# Altium schematic sheet QCopterFC_PWM_Sch.SchDoc
size A4
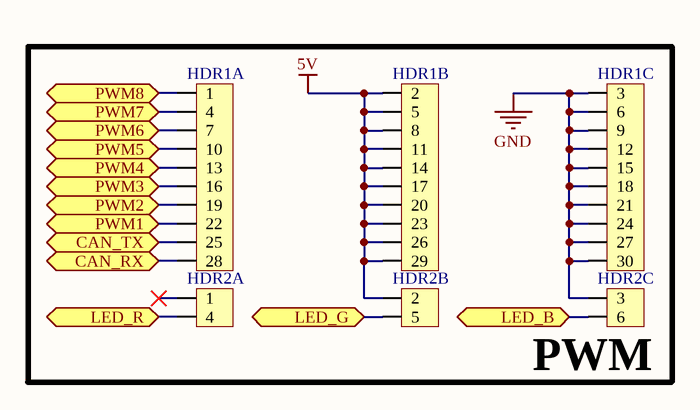
[diagram p0: QCopterFC_PWM_Sch.SchDoc]

## Parts
HDR1  HDR3X10_90_2.54  [HDR3X10_90_2.54]  (value not drawn)  (parts A,B,C of 3)
HDR2  HDR3X2_90_2.54  [HDR3X2_90_2.54]  (value not drawn)  (parts A,B,C of 3)

## Blocks framed on the sheet
PWM: HDR1 HDR2

## Ports
CAN_RX, CAN_TX, LED_B, LED_G, LED_R, PWM1, PWM2, PWM3, PWM4, PWM5, PWM6, PWM7, PWM8

## Nets
5V: HDR1.2 HDR1.5 HDR1.8 HDR1.11 HDR1.14 HDR1.17 HDR1.20 HDR1.23 HDR1.26 HDR1.29 HDR2.2
GND: HDR1.3 HDR1.6 HDR1.9 HDR1.12 HDR1.15 HDR1.18 HDR1.21 HDR1.24 HDR1.27 HDR1.30 HDR2.3
CAN_RX: HDR1.28 ; port CAN_RX
CAN_TX: HDR1.25 ; port CAN_TX
LED_B: HDR2.6 ; port LED_B
LED_G: HDR2.5 ; port LED_G
LED_R: HDR2.4 ; port LED_R
PWM1: HDR1.22 ; port PWM1
PWM2: HDR1.19 ; port PWM2
PWM3: HDR1.16 ; port PWM3
PWM4: HDR1.13 ; port PWM4
PWM5: HDR1.10 ; port PWM5
PWM6: HDR1.7 ; port PWM6
PWM7: HDR1.4 ; port PWM7
PWM8: HDR1.1 ; port PWM8

Not connected (* = marked no-connect by the designer): HDR2 1*

## Library data of the parts
HDR1 = HDR3X10_90_2.54: Header
HDR2 = HDR3X2_90_2.54: Header